# Altium schematic sheet TF-0041_TF-004.schdoc
size 127 x 99 mm
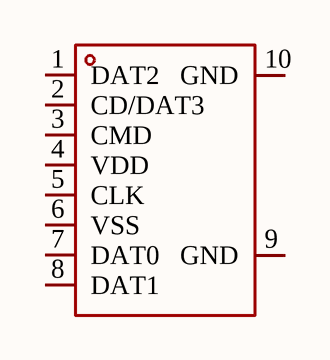
[diagram p0: TF-0041_TF-004.schdoc]

## Parts
CARD?  TF-004  [TF-SMD_TF-004]  (value not drawn)

## Nets

Not connected (* = marked no-connect by the designer): CARD? 1(DAT2) 2(CD/DAT3) 3(CMD) 4(VDD) 5(CLK) 6(VSS) 7(DAT0) 8(DAT1) 9(GND) 10(GND)

## Library data of the parts
CARD? = TF-004: Manufacturer: SOFNG(硕方); Add into BOM: yes; Card Connection Mode: Pluggable; Card Type: MicroSD卡(TF卡); Connector Type: Deck; Maximum Body Height: 1.9mm; Symbol: TF-004; Device: TF-004; LCSC Part Name: 拔插式 MicroSD卡(TF卡) 卡座; Supplier Part: C428454; Manufacturer Part: TF-004; Supplier Footprint: SMD; JLCPCB Part Class: Extended Part; Datasheet: https://atta.szlcsc.com/upload/public/pdf/source/20190912/C428454_2BE6F79889BF403D2E695CFF3470C888.pdf; Supplier: LCSC; Convert to PCB: yes; Operating Temperature Range: -